# EasyEDA schematic SchematicEasyEDA.json
TITLE: PX8-20H-01; REV: 1.0; Date: 2026-08-27; Sheet: 1/1; Company: Chowder INC
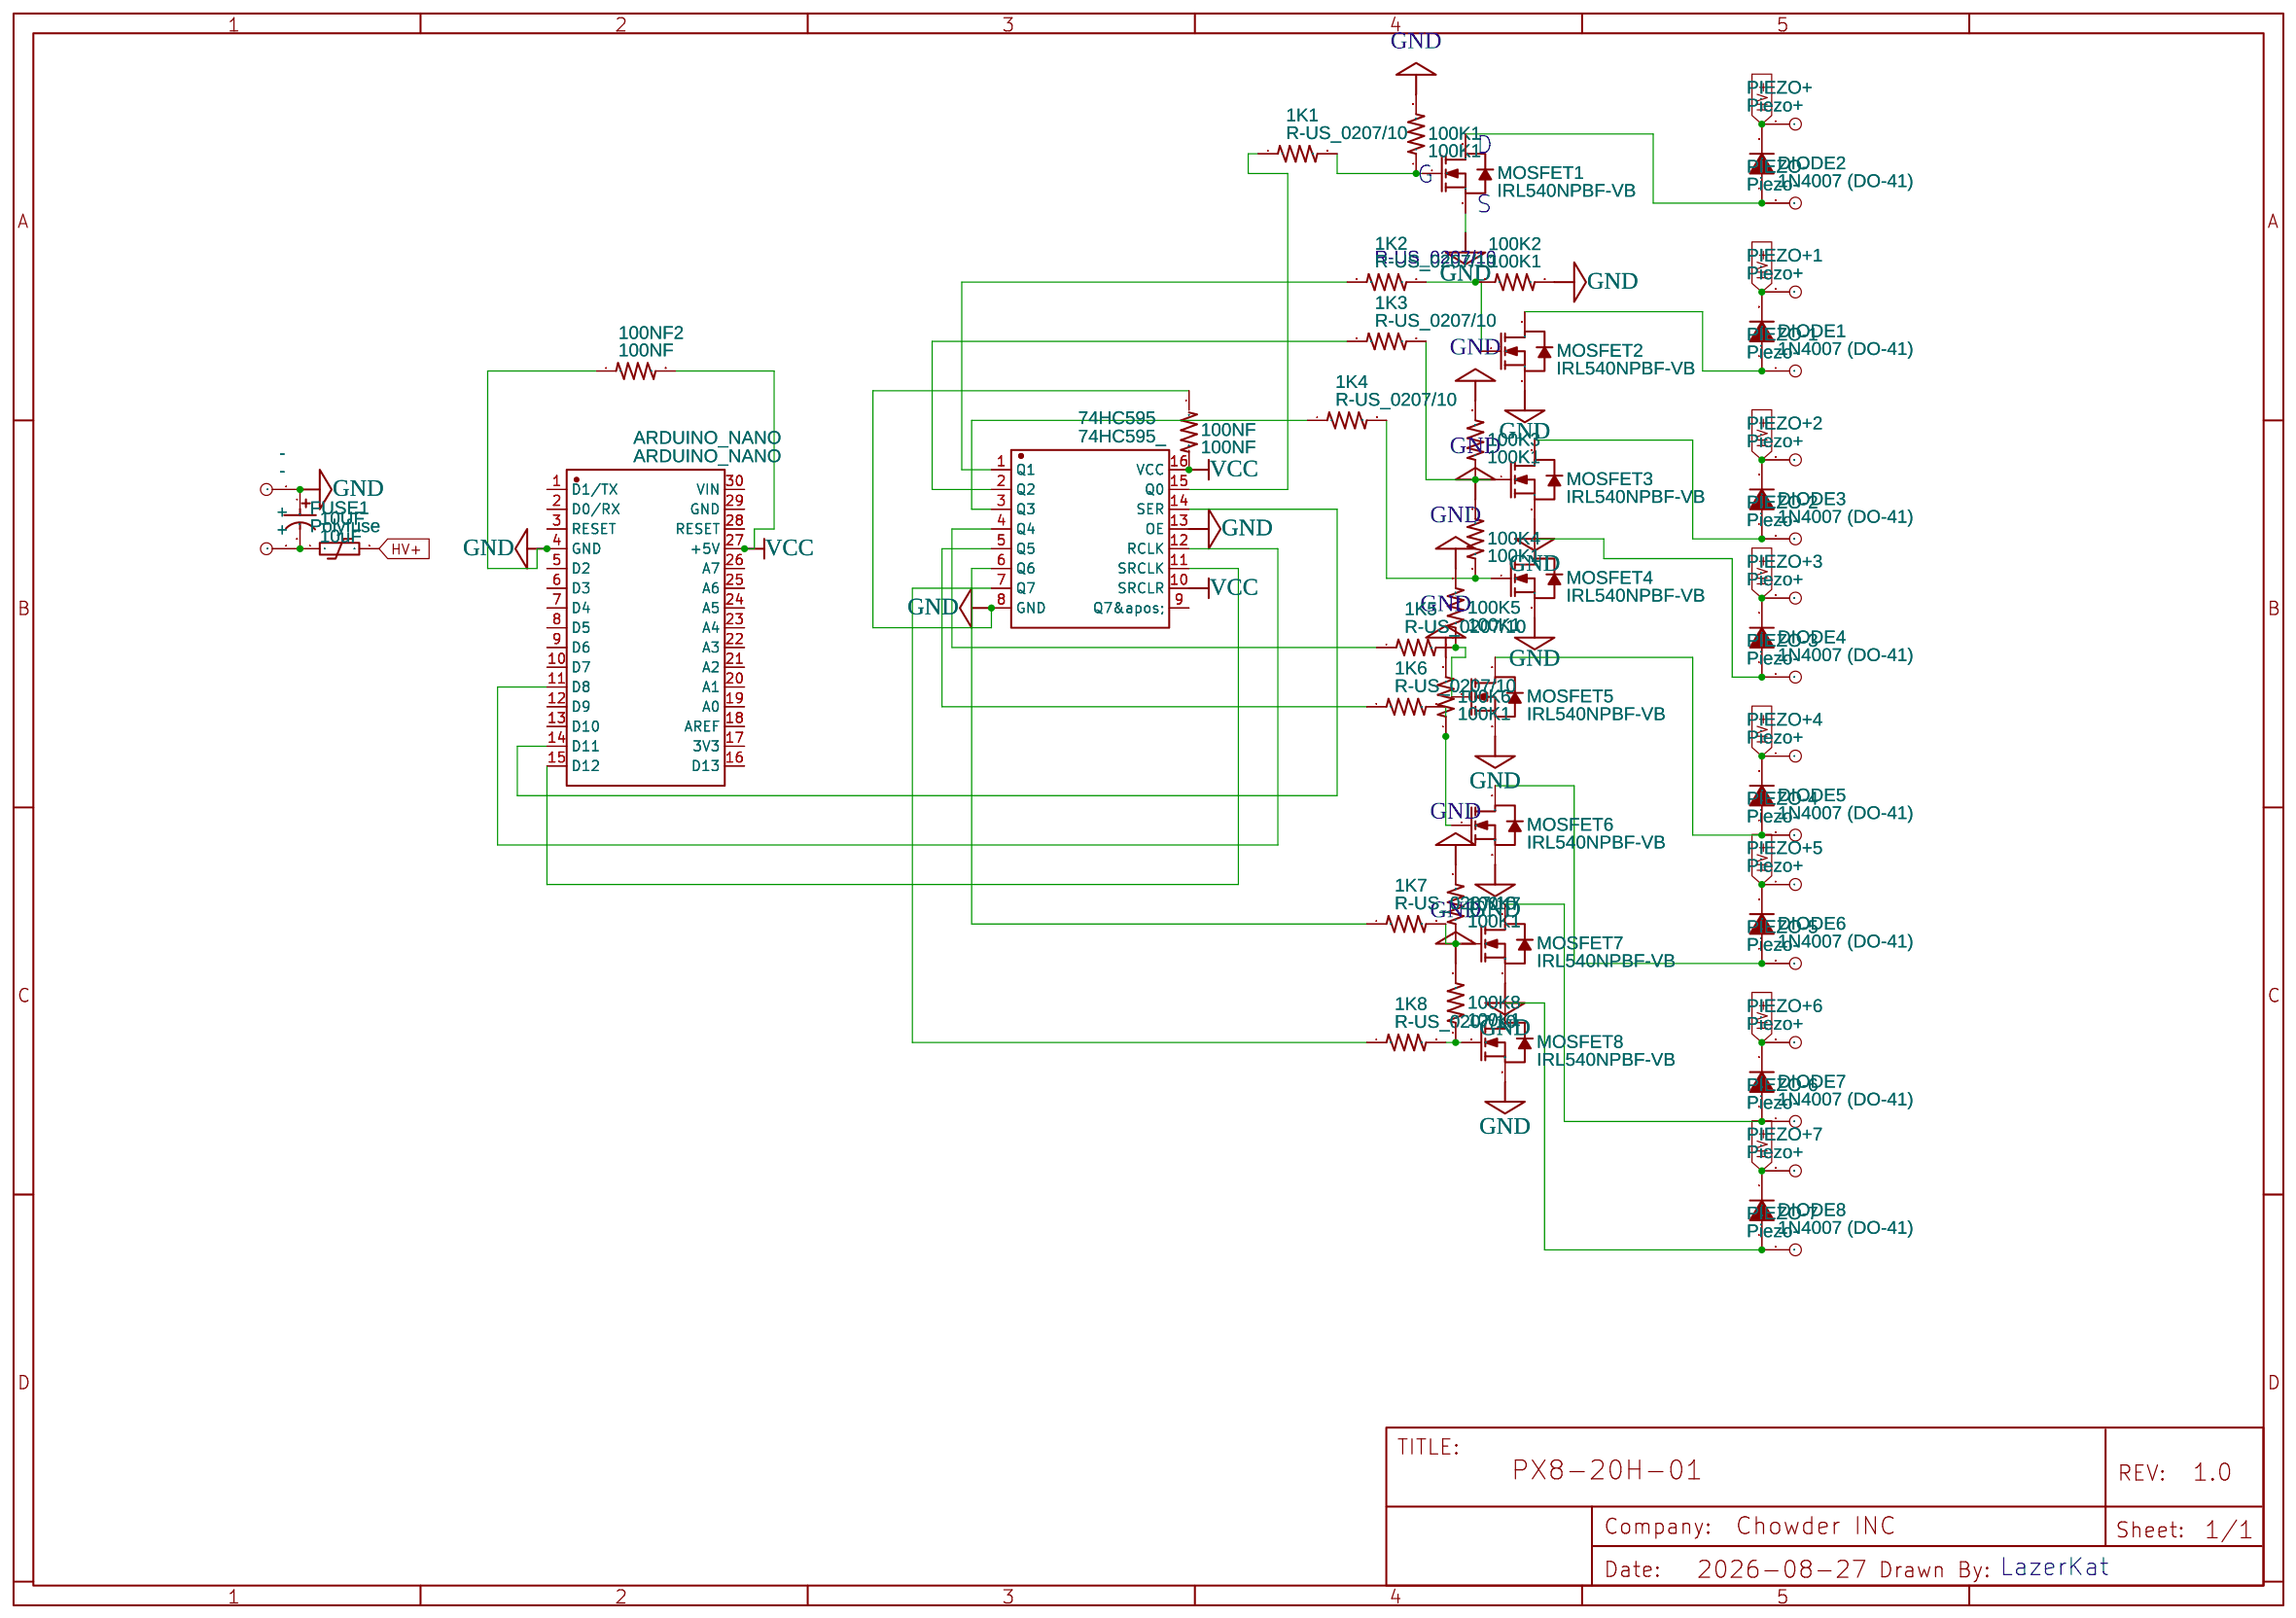
[diagram p0: schematic sheet]

## Parts
1K1  R-US_0207/10  [0207/10]
1K2  R-US_0207/10  [0207/10]
1K3  R-US_0207/10  [0207/10]
1K4  R-US_0207/10  [0207/10]
1K5  R-US_0207/10  [0207/10]
1K6  R-US_0207/10  [0207/10]
1K7  R-US_0207/10  [0207/10]
1K8  R-US_0207/10  [0207/10]
10UF  10uF  [10UF 100V]
74HC595  74HC595_  [74HC595]
100K1  100K1  [0207/10]
100K2  100K1  [0207/10]
100K3  100K1  [0207/10]
100K4  100K1  [0207/10]
100K5  100K1  [0207/10]
100K6  100K1  [0207/10]
100K7  100K1  [0207/10]
100K8  100K1  [0207/10]
100NF  100NF  [0207/10]
100NF2  100NF  [0207/10]
+  +  [THROUGHHOLEPIN]
-  -  [THROUGHHOLEPIN]
ARDUINO_NANO  ARDUINO_NANO  [COMM-TH_ARDUINO_NANO]
DIODE1  1N4007 (DO-41)  [1N4007_(DO-41)]
DIODE2  1N4007 (DO-41)  [1N4007_(DO-41)]
DIODE3  1N4007 (DO-41)  [1N4007_(DO-41)]
DIODE4  1N4007 (DO-41)  [1N4007_(DO-41)]
DIODE5  1N4007 (DO-41)  [1N4007_(DO-41)]
DIODE6  1N4007 (DO-41)  [1N4007_(DO-41)]
DIODE7  1N4007 (DO-41)  [1N4007_(DO-41)]
DIODE8  1N4007 (DO-41)  [1N4007_(DO-41)]
FUSE1  Polyfuse  [POLYFUSE FOOTPRINT]
MOSFET1  IRL540NPBF-VB  [TO-220AB-3_L10.4-W4.6-P2.54-L]
MOSFET2  IRL540NPBF-VB  [TO-220AB-3_L10.4-W4.6-P2.54-L]
MOSFET3  IRL540NPBF-VB  [TO-220AB-3_L10.4-W4.6-P2.54-L]
MOSFET4  IRL540NPBF-VB  [TO-220AB-3_L10.4-W4.6-P2.54-L]
MOSFET5  IRL540NPBF-VB  [TO-220AB-3_L10.4-W4.6-P2.54-L]
MOSFET6  IRL540NPBF-VB  [TO-220AB-3_L10.4-W4.6-P2.54-L]
MOSFET7  IRL540NPBF-VB  [TO-220AB-3_L10.4-W4.6-P2.54-L]
MOSFET8  IRL540NPBF-VB  [TO-220AB-3_L10.4-W4.6-P2.54-L]
PIEZO+  Piezo+  [THROUGHHOLEPIN]
PIEZO+1  Piezo+  [THROUGHHOLEPIN]
PIEZO+2  Piezo+  [THROUGHHOLEPIN]
PIEZO+3  Piezo+  [THROUGHHOLEPIN]
PIEZO+4  Piezo+  [THROUGHHOLEPIN]
PIEZO+5  Piezo+  [THROUGHHOLEPIN]
PIEZO+6  Piezo+  [THROUGHHOLEPIN]
PIEZO+7  Piezo+  [THROUGHHOLEPIN]
PIEZO-  Piezo-  [THROUGHHOLEPIN]
PIEZO-1  Piezo-  [THROUGHHOLEPIN]
PIEZO-2  Piezo-  [THROUGHHOLEPIN]
PIEZO-3  Piezo-  [THROUGHHOLEPIN]
PIEZO-4  Piezo-  [THROUGHHOLEPIN]
PIEZO-5  Piezo-  [THROUGHHOLEPIN]
PIEZO-6  Piezo-  [THROUGHHOLEPIN]
PIEZO-7  Piezo-  [THROUGHHOLEPIN]

## Library data of the parts
1K1-1K8 100K1-100K8 100NF 100NF2 = R-US_0207/10: Contributor: jpscuro
10UF = 10UF 100V: Manufacturer: AISHI; Manufacturer Part: ERS1KM100E11OT; Supplier Part: C106677; Contributor: PratikPatel
74HC595 = 74HC595_: Supplier Part: C110383; Supplier: LCSC; Manufacturer: FM; Manufacturer Part: 74HC595A; Contributor: Kamikazse
+ - PIEZO+ PIEZO+1-PIEZO+7 PIEZO- PIEZO-1-PIEZO-7 = Through-hole pin: Contributor: kbluekdh
ARDUINO_NANO = ARDUINO_NANO: Contributor: lcsc; Supplier: LCSC; Supplier Part: C9900017879; Manufacturer: null; JLCPCB Part Class: Extended Part
DIODE1-DIODE8 = 1N4007 (DO-41): Manufacturer Part: 1 N 4007; Supplier: SOS electronic; Supplier Part: 1 N 4007; Contributor: Sarathlal
FUSE1 = Polyfuse: Contributor: qrtz978
MOSFET1-MOSFET8 = IRL540NPBF-VB: Contributor: lcsc; Supplier: LCSC; Supplier Part: C5240567; Manufacturer: VBsemi(微碧半导体); JLCPCB Part Class: Extended Part

## Nets
GND: 10UF.1 74HC595.8(GND) 74HC595.13(OE) 100K1.2 100K2.2 100K3.2 100K4.2 100K5.2 100K6.2 100K7.2 100K8.2 100NF.1 100NF2.1 -.1 ARDUINO_NANO.4(GND) MOSFET1.3(S) MOSFET2.3(S) MOSFET3.3(S) MOSFET4.3(S) MOSFET5.3(S) MOSFET6.3(S) MOSFET7.3(S) MOSFET8.3(S)
VCC: 74HC595.10(SRCLR) 74HC595.16(VCC) 100NF.2 100NF2.2 ARDUINO_NANO.27(+5V)
HV+: DIODE1.C DIODE2.C DIODE3.C DIODE4.C DIODE5.C DIODE6.C DIODE7.C DIODE8.C FUSE1.2 PIEZO+.1 PIEZO+1.1 PIEZO+2.1 PIEZO+3.1 PIEZO+4.1 PIEZO+5.1 PIEZO+6.1 PIEZO+7.1
Net-(1K1-1): 1K1.1 74HC595.15(Q0)
Net-(1K1-2): 1K1.2 100K1.1 MOSFET1.1(G)
Net-(1K2-1): 1K2.1 74HC595.1(Q1)
Net-(1K2-2): 1K2.2 100K2.1 MOSFET2.1(G)
Net-(1K3-1): 1K3.1 74HC595.2(Q2)
Net-(1K3-2): 1K3.2 100K3.1 MOSFET3.1(G)
Net-(1K4-1): 1K4.1 74HC595.3(Q3)
Net-(1K4-2): 1K4.2 100K4.1 MOSFET4.1(G)
Net-(1K5-1): 1K5.1 74HC595.4(Q4)
Net-(1K5-2): 1K5.2 100K5.1 MOSFET5.1(G)
Net-(1K6-1): 1K6.1 74HC595.5(Q5)
Net-(1K6-2): 1K6.2 100K6.1 MOSFET6.1(G)
Net-(1K7-1): 1K7.1 74HC595.6(Q6)
Net-(1K7-2): 1K7.2 100K7.1 MOSFET7.1(G)
Net-(1K8-1): 1K8.1 74HC595.7(Q7)
Net-(1K8-2): 1K8.2 100K8.1 MOSFET8.1(G)
Net-(10UF-2): 10UF.2 +.1 FUSE1.1
Net-(74HC595-11): 74HC595.11(SRCLK) ARDUINO_NANO.15(D12)
Net-(74HC595-12): 74HC595.12(RCLK) ARDUINO_NANO.11(D8)
Net-(74HC595-14): 74HC595.14(SER) ARDUINO_NANO.14(D11)
Net-(DIODE1-A): DIODE1.A MOSFET2.2(D) PIEZO-1.1
Net-(DIODE2-A): DIODE2.A MOSFET1.2(D) PIEZO-.1
Net-(DIODE3-A): DIODE3.A MOSFET3.2(D) PIEZO-2.1
Net-(DIODE4-A): DIODE4.A MOSFET4.2(D) PIEZO-3.1
Net-(DIODE5-A): DIODE5.A MOSFET5.2(D) PIEZO-4.1
Net-(DIODE6-A): DIODE6.A MOSFET6.2(D) PIEZO-5.1
Net-(DIODE7-A): DIODE7.A MOSFET7.2(D) PIEZO-6.1
Net-(DIODE8-A): DIODE8.A MOSFET8.2(D) PIEZO-7.1

Not connected (* = marked no-connect by the designer): 74HC595 9(Q7'); ARDUINO_NANO 1(D1/TX) 2(D0/RX) 3(RESET) 5(D2) 6(D3) 7(D4) 8(D5) 9(D6) 10(D7) 12(D9) 13(D10) 16(D13) 17(3V3) 18(AREF) 19(A0) 20(A1) 21(A2) 22(A3) 23(A4) 24(A5) 25(A6) 26(A7) 28(RESET) 29(GND) 30(VIN)

## Notes on the sheet
- D
- G
- S
- R-US_0207/10
- LazerKat
